# Altium project MotionBoard.PrjPcb (part 3 of 3)

## Sheet ext-memory.SchDoc: DSP External Memory
size A4; SheetNumber: 9; SheetTotal: 17
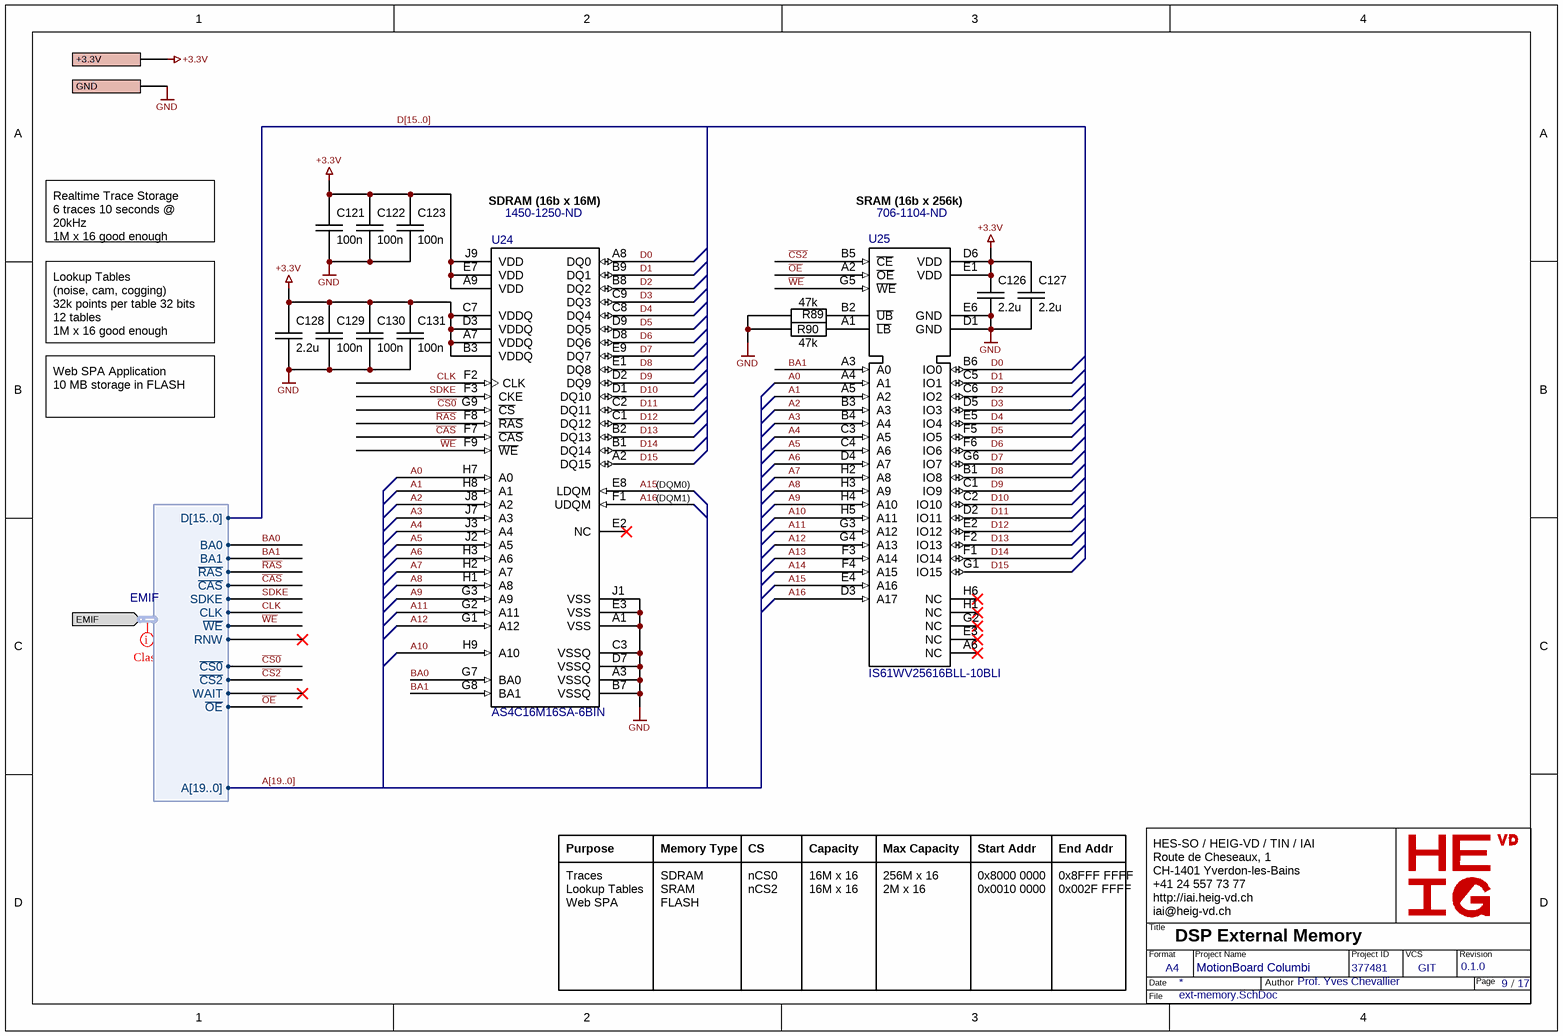
[diagram p10: ext-memory.SchDoc]

### Parts
C121  value 100n  [SM/C0201]  (hidden comment: CL05A104KP5NNNC)
C122  value 100n  [SM/C0201]  (hidden comment: CL05A104KP5NNNC)
C123  value 100n  [SM/C0201]  (hidden comment: CL05A104KP5NNNC)
C126  value 2.2u  [SM/C0402]  (hidden comment: CL05A225MQ5NNNC)
C127  value 2.2u  [SM/C0402]  (hidden comment: CL05A225MQ5NNNC)
C128  2.2u  [SM/C0402]
C129  value 100n  [SM/C0201]  (hidden comment: CL05A104KP5NNNC)
C130  value 100n  [SM/C0201]  (hidden comment: CL05A104KP5NNNC)
C131  value 100n  [SM/C0201]  (hidden comment: CL05A104KP5NNNC)
R89  47k  [SM/R0402]
R90  47k  [SM/R0402]
U24  AS4C16M16SA-6BIN  Supplier Part Number 1: 1450-1250-ND  [TFBGA-54]
U25  IS61WV25616BLL-10BLI  Supplier Part Number 1: 706-1104-ND  [BGA48C75P8X6_800X600X120N]

### Ports
+3.3V, EMIF (in, harness EMIF), GND

### Harnesses
EMIF: A[19..0], D[15..0], ~{RAS}, ~{CAS}, ~{OE}, SDKE, CLK, ~{CS0}, ~{CS2}, BA0, BA1, ~{WE}, RNW, WAIT

### Nets
+3.3V: C121.1 C122.1 C123.1 C126.1 C127.1 C128.1 C129.1 C130.1 C131.1 U24.A7(VDDQ) U24.A9(VDD) U24.B3(VDDQ) U24.C7(VDDQ) U24.D3(VDDQ) U24.E7(VDD) U24.J9(VDD) U25.D6(VDD) U25.E1(VDD) ; port +3.3V
GND: C121.2 C122.2 C123.2 C126.2 C127.2 C128.2 C129.2 C130.2 C131.2 R89.1 R90.1 U24.A1(VSS) U24.A3(VSSQ) U24.B7(VSSQ) U24.C3(VSSQ) U24.D7(VSSQ) U24.E3(VSS) U24.J1(VSS) U25.D1(GND) U25.E6(GND) ; port GND
A0: U24.H7(A0) U25.A4(A1)
A1: U24.H8(A1) U25.A5(A2)
A2: U24.J8(A2) U25.B3(A3)
A3: U24.J7(A3) U25.B4(A4)
A4: U24.J3(A4) U25.C3(A5)
A5: U24.J2(A5) U25.C4(A6)
A6: U24.H3(A6) U25.D4(A7)
A7: U24.H2(A7) U25.H2(A8)
A8: U24.H1(A8) U25.H3(A9)
A9: U24.G3(A9) U25.H4(A10)
A10: U24.H9(A10) U25.H5(A11)
A11: U24.G2(A11) U25.G3(A12)
A12: U24.G1(A12) U25.G4(A13)
A13: U25.F3(A14)
A14: U25.F4(A15)
A15: U24.E8(LDQM) U25.E4(A16)
A16: U24.F1(UDQM) U25.D3(A17)
BA0: U24.G7(BA0) ; port EMIF.BA0
BA1: U24.G8(BA1) U25.A3(A0) ; port EMIF.BA1
~{CAS}: U24.F7(~{CAS}) ; port EMIF.~{CAS}
~{CS0}: U24.G9(~{CS}) ; port EMIF.~{CS0}
~{CS2}: U25.B5(~{CE}) ; port EMIF.~{CS2}
CLK: U24.F2(CLK) ; port EMIF.CLK
D0: U24.A8(DQ0) U25.B6(IO0)
D1: U24.B9(DQ1) U25.C5(IO1)
D2: U24.B8(DQ2) U25.C6(IO2)
D3: U24.C9(DQ3) U25.D5(IO3)
D4: U24.C8(DQ4) U25.E5(IO4)
D5: U24.D9(DQ5) U25.F5(IO5)
D6: U24.D8(DQ6) U25.F6(IO6)
D7: U24.E9(DQ7) U25.G6(IO7)
D8: U24.E1(DQ8) U25.B1(IO8)
D9: U24.D2(DQ9) U25.C1(IO9)
D10: U24.D1(DQ10) U25.C2(IO10)
D11: U24.C2(DQ11) U25.D2(IO11)
D12: U24.C1(DQ12) U25.E2(IO12)
D13: U24.B2(DQ13) U25.F2(IO13)
D14: U24.B1(DQ14) U25.F1(IO14)
D15: U24.A2(DQ15) U25.G1(IO15)
~{OE}: U25.A2(~{OE}) ; port EMIF.~{OE}
~{RAS}: U24.F8(~{RAS}) ; port EMIF.~{RAS}
SDKE: U24.F3(CKE) ; port EMIF.SDKE
~{WE}: U24.F9(~{WE}) U25.G5(~{WE}) ; port EMIF.~{WE}
NetR89_2: R89.2 U25.B2(~{UB})
NetR90_2: R90.2 U25.A1(~{LB})

Not connected (* = marked no-connect by the designer): U24 E2(NC)*; U25 A6(NC)* E3(NC)* G2(NC)* H1(NC)* H6(NC)*

### Buses and harness runs
bus A[19..0]
bus D[15..0]

### Layout directives
net class EMIF: (no net found under the mark)

### Notes on the sheet
- Realtime Trace Storage
  6 traces 10 seconds @ 20kHz
  1M x 16 good enough
- SDRAM (16b x 16M)
- SRAM (16b x 256k)
- Lookup Tables
  (noise, cam, cogging)
  32k points per table 32 bits
  12 tables
  1M x 16 good enough
- Web SPA Application
  10 MB storage in FLASH
- (DQM0)
- (DQM1)
- Purpose
- Memory Type
- CS
- Capacity
- Max Capacity
- Start Addr
- End Addr
- Traces
- Web SPA
- Lookup Tables
- SDRAM
- SRAM
- FLASH
- nCS0
- nCS2
- 16M x 16
- 256M x 16
- 2M x 16
- 0x8000 0000
- 0x0010 0000
- 0x8FFF FFFF
- 0x002F FFFF
- HES-SO / HEIG-VD / TIN / IAI
  Route de Cheseaux, 1
  CH-1401 Yverdon-les-Bains
  +41 24 557 73 77
  http://iai.heig-vd.ch
  iai@heig-vd.ch
- Title
- Format
- Date
- A4
- Project Name
- Author
- Project ID
- VCS
- Revision
- Page
- /
- File

### Library data of the parts
C121-C123 C129-C131 = C: as C189-C193 on sheet adc; Supplier 1: Digi-Key; Supplier Part Number 1: 1276-1022-1-ND
C126 C127 = C: CAP CER 10UF 10V X5R 0805; Voltage: 6.3V; Supplier 1: Digi-Key; Supplier Part Number 1: 1276-1469-1-ND
C128 = C: GRM155R61C225KE11D; Dielectric: X5R; Voltage: 16V; Supplier 1: Digi-Key; Supplier Part Number 1: 490-10695-1-ND
R89 R90 = R: 47 kOhms ±1% 0.063W, 1/16W Chip Resistor 0402 (1005 Metric) Moisture Resistant Thick Film; Value: 47k; Supplier 1: Digi-Key; Supplier Part Number 1: 311-47.0KLRCT-ND
U24 = AS4C16M16SA-6BIN: IC DRAM 256MBIT PARALLEL 54TFBGA / SDRAM Memory IC 256Mb (16M x 16) Parallel 166 MHz 5 ns 54-TFBGA (8x8); Supplier 1: Digi-Key
U25 = IS61WV25616BLL-10BLI: SRAM - Asynchronous Memory IC 4Mb (256K x 16) Parallel 10 ns 48-TFBGA (6x8); Supplier 1: Digi-Key

## Sheet usb.SchDoc: Micro USB Host/Device Port
size A4; SheetNumber: 12; SheetTotal: 18
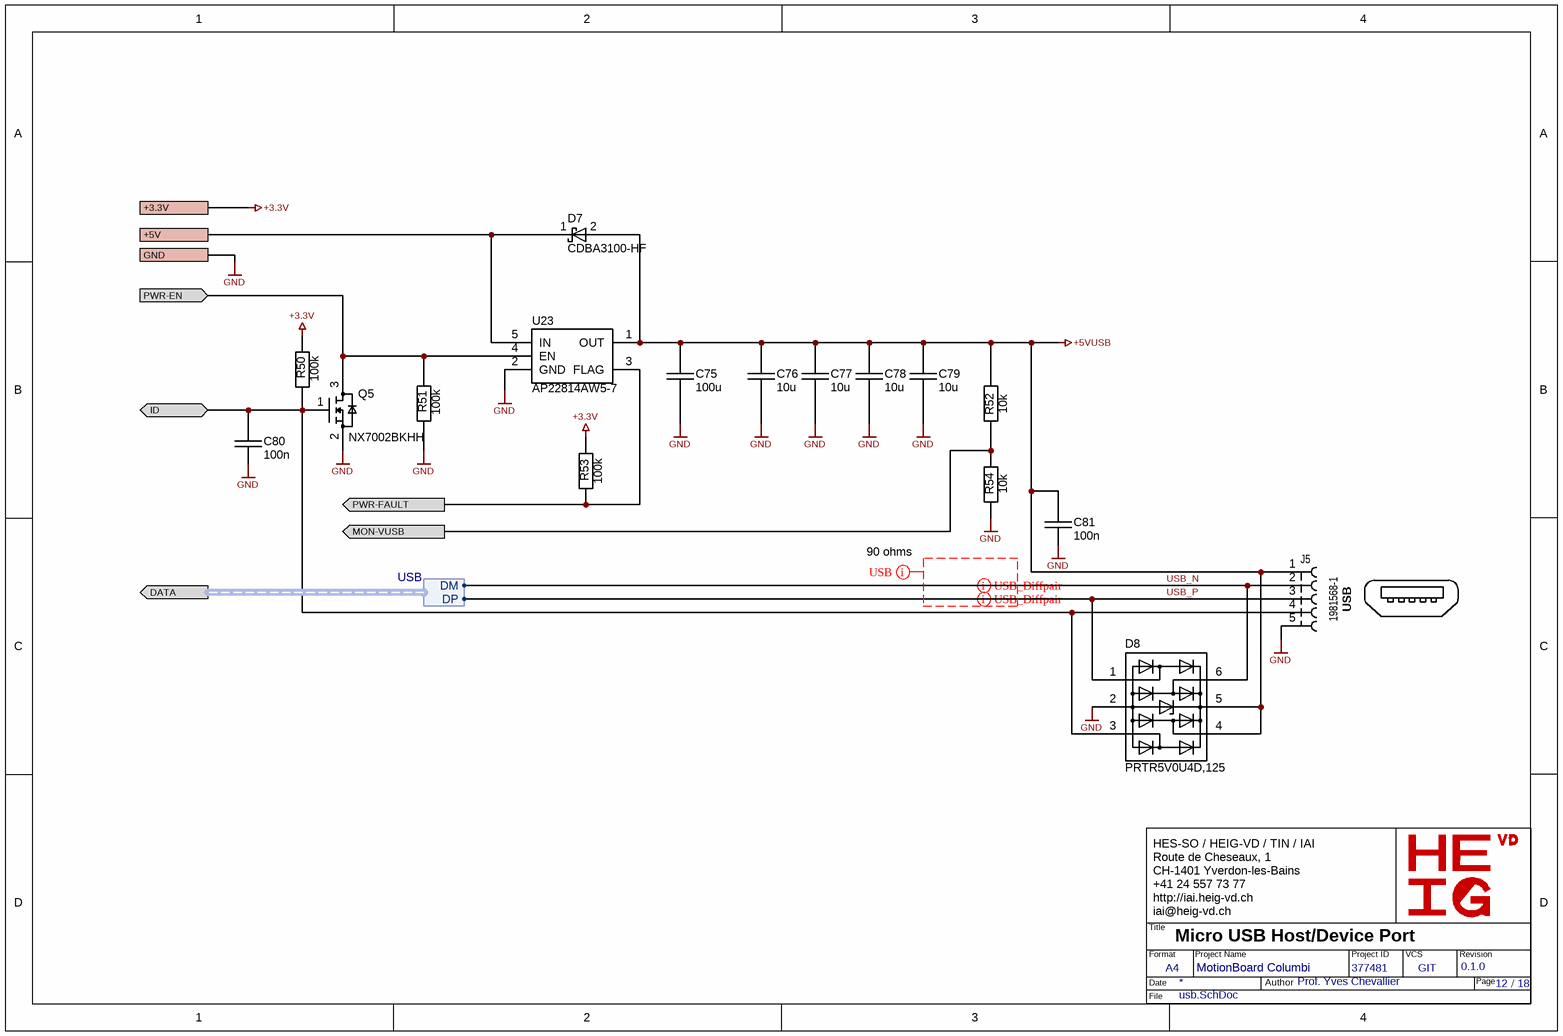
[diagram p11: usb.SchDoc]

### Parts
(Parts that share a designator on the sheet are numbered #1, #2 ... from top to bottom, then left to right.)
C75  100u  [SM/C1210]
C76  10u  [SM/C0603]
C77  10u  [SM/C0603]
C78  10u  [SM/C0603]
C79  10u  [SM/C0603]
C80  100n  [SM/C0402]
C81  100n  [SM/C0402]
D7  CDBA3100-HF  [DO214AC]
D8  PRTR5V0U4D,125  [SOT23-6]
J5#2  1981568-1  Function: USB  [TE/1981568-1/USB]
Q5  NX7002BKHH  [SOT8001/DFN0606-3]
R50  100k  [SM/R0805]
R51  100k  [SM/R0805]
R52  10k  [SM/R0402]
R53  100k  [SM/R0805]
R54  10k  [SM/R0402]
U23  AP22814AW5-7  [SOT23-5]

### Ports
+3.3V, +5V, DATA (out, harness USB), GND, ID (bidir), MON-VUSB (out), PWR-EN (in), PWR-FAULT (out)

### Harnesses
USB: DP, DM

### Nets
+3.3V: R50.2 R53.2 ; port +3.3V
+5V: D7.1(K) U23.5(IN) ; port +5V
+5VUSB: C75.1 C76.1 C77.1 C78.1 C79.1 C81.1 D7.2(A) D8.4(ESD3) D8.5(GND) J5#2.1 R52.2 U23.1(OUT)
GND: C75.2 C76.2 C77.2 C78.2 C79.2 C80.2 C81.2 D8.2(VCC) J5#2.5 Q5.2(VCC) R51.1 R54.1 U23.2(GND) ; port GND
ID: C80.1 D8.3(ESD2) J5#2.4 Q5.1(VCC) R50.1 ; port ID
MON-VUSB: R52.1 R54.2 ; port MON-VUSB
PWR-EN: Q5.3(VCC) R51.2 U23.4(EN) ; port PWR-EN
PWR-FAULT: R53.1 U23.3(FLAG) ; port PWR-FAULT
USB_N: D8.6(ESD4) J5#2.2 ; port DATA.DM
USB_P: D8.1(ESD1) J5#2.3 ; port DATA.DP

### Layout directives
differential pair: USB_N, USB_P
rule Impedance Constraint [Min = 85.00    Max = 95.00    ]; Impedance: 90 ohms; rule Differential Pairs Routing [Pref Gap = 6.43mil    Min Gap  = 5.906mil    Max Gap  = 6.43milPref Width = 9.048mil    Min Width  = 5.906mil    Max Width  = 9.048mil]; rule Matched Net Lengths [Tolerance = 10mil]; net class USB: (no net found under the mark)

### Notes on the sheet
- HES-SO / HEIG-VD / TIN / IAI
  Route de Cheseaux, 1
  CH-1401 Yverdon-les-Bains
  +41 24 557 73 77
  http://iai.heig-vd.ch
  iai@heig-vd.ch
- Title
- Format
- Date
- A4
- Project Name
- Author
- Project ID
- VCS
- Revision
- Page
- /
- File

### Library data of the parts
C75 = CAP CER 100UF 10V X5R 1210: 100 µF ±20% 10V Ceramic Capacitor X5R 1210 (3225 Metric); Supplier 1: Digi-Key; Supplier Part Number 1: 1276-3364-1-ND; Value: 100u; Voltage: 10V; Dielectric: X5R
C76-C79 = CAP CER 10UF 25V X5R 0603: 10 µF ±20% 25V Ceramic Capacitor X5R 0603 (1608 Metric); Dielectric: X7R; Supplier 1: Digi-Key; Supplier Part Number 1: 490-7202-1-ND; Voltage: 25V; Value: 10u
C80 C81 = CAP CER 100NF 25V X5R 0402: 100 nF ±10% 25V Ceramic Capacitor X5R 0402 (1005 Metric); Voltage: 25V; Dielectric: X5R; Supplier 1: Digi-Key; Supplier Part Number 1: 1276-1043-1-ND; Value: 100n
D7 = DIODE SCHOTTKY 100V 3A DO214AC: Diode 100 V 3A Surface Mount DO-214AC (SMA); Supplier 1: Digi-Key; Supplier Part Number 1: 641-1747-1-ND
D8 = PRTR5V0U4D: Ultra low capacitance quadruple rail-to-rail ESD protection, surface mount 6-TSOP; Mounting: SMD; Supplier 1: Digi-Key; Supplier Part Number 1: 1727-3890-1-ND; Supplier 2: Mouser; Supplier Part Number 2: 771-PRTR5V0U4D-T/R
J5#2 = CONN 5 Socket: USB - micro B USB 2.0 Receptacle Connector 5 Position Surface Mount, Right Angle; Supplier 1: Digi-Key; Supplier Part Number 1: A97800CT-ND
Q5 = 2N7002: N-Channel 60 V 350mA (Ta) 380mW (Ta), 2.8W (Tc) Surface Mount DFN0606-3; Value: 2N7002; Supplier 1: Digi-Key; Supplier Part Number 1: 1727-8574-1-ND
R50 R51 R53 = RES 100K OHM 1% 1/16W 0402: 100 kOhms ±1% 0.063W, 1/16W Chip Resistor 0402 (1005 Metric) Moisture Resistant Thick Film; Supplier 1: Digi-Key; Supplier Part Number 1: 13-RC0402FR-13100KLCT-ND; Value: 100k
R52 R54 = RES 10K OHM 1% 1/16W 0402: 10 kOhms ±1% 0.063W, 1/16W Chip Resistor 0402 (1005 Metric) Moisture Resistant Thick Film; Supplier 1: Digi-Key; Supplier Part Number 1: 1276-3431-1-ND; Value: 10k
U23 = AP22804: Power Switch/Driver 1:1 P-Channel 3A SOT-25; Supplier 1: Digi-Key; Supplier Part Number 1: AP22814AW5-7DICT-ND

## Sheet resolver-excitation.SchDoc: Resolver Excitation
size A4; SheetNumber: 12; SheetTotal: 17
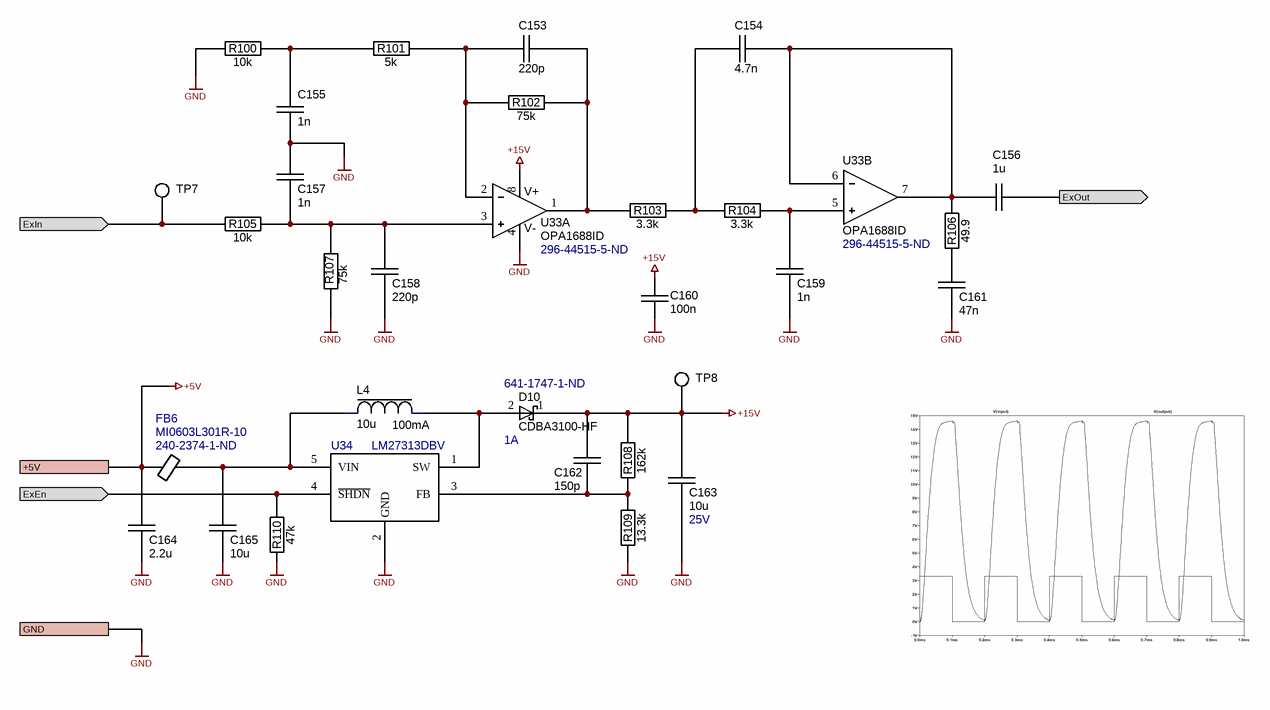
[diagram p12: resolver-excitation.SchDoc]

### Parts
(Parts that share a designator on the sheet are numbered #1, #2 ... from top to bottom, then left to right.)
C153  220p  [SM/C0402]
C154  4.7n  [SM/C0402]
C155  1n  [SM/C0402]
C156  1u  [SM/C0402]
C157  1n  [SM/C0402]
C158  220p  [SM/C0402]
C159  1n  [SM/C0402]
C160  100n  [SM/C0402]
C161  47n  [SM/C0402]
C162  150p  [SM/C0603]
C163  10u  Voltage: 25V  [SM/C0603]
C164  2.2u  [SM/C0402]
C165  10u  [SM/C0603]
D10  CDBA3100-HF  Current: 1A  Supplier Part Number 1: 641-1747-1-ND  [DO214AC]
FB6#2  MI0603L301R-10  Supplier Part Number 1: 240-2374-1-ND  [SM/L0603]
L4  10u  Isat: 100mA  [SM/L0805]
R100  10k  [SM/R0402]
R101  5k  [SM/R0402]
R102  75k  [SM/R0402]
R103  3.3k  [SM/R0402]
R104  3.3k  [SM/R0402]
R105  10k  [SM/R0402]
R106  49.9  [SM/R0402]
R107  75k  [SM/R0402]
R108  162k  [SM/R0402]
R109  13.3k  [SM/R0402]
R110  47k  [SM/R0402]
TP7#2  RCUCTE  [TP/RCUCT]  (value not drawn)
TP8  RCUCTE  [TP/RCUCT]  (value not drawn)
U33  OPA1688ID  Supplier Part Number 1: 296-44515-5-ND  [SOIC8]  (parts A,B of 2)
U34  LM27313DBV  [SOT23-6]

### Ports
+5V, ExEn (in), ExIn (in), ExOut (out), GND

### Nets
+5V: C164.1 FB6#2.1 ; port +5V
+15V: C160.1 C162.1 C163.1 D10.1(K) R108.1 TP8.1 U33.8(V+)
GND: C155.2 C157.1 C158.2 C159.2 C160.2 C161.2 C163.2 C164.2 C165.2 R100.2 R107.1 R109.1 R110.1 U33.4(V-) U34.2(GND) ; port GND
ExEn: R110.2 U34.4(~{SHDN}) ; port ExEn
ExIn: R105.1 TP7#2.1 ; port ExIn
ExOut: C156.2 ; port ExOut
NetC153_1: C153.1 R101.1 R102.2 U33.2(IN-)
NetC153_2: C153.2 R102.1 R103.2 U33.1(OUT)
NetC154_1: C154.1 R103.1 R104.2
NetC154_2: C154.2 C156.1 R106.1 U33.6(IN-) U33.7(OUT)
NetC155_1: C155.1 R100.1 R101.2
NetC157_2: C157.2 C158.1 R105.2 R107.2 U33.3(IN+)
NetC159_1: C159.1 R104.1 U33.5(IN+)
NetC161_1: C161.1 R106.2
NetC162_2: C162.2 R108.2 R109.2 U34.3(FB)
NetC165_1: C165.1 FB6#2.2 L4.2 U34.5(VIN)
NetD10_2: D10.2(A) L4.1 U34.1(SW)

### Notes on the sheet
- HES-SO / HEIG-VD / TIN / IAI
  Route de Cheseaux, 1
  CH-1401 Yverdon-les-Bains
  +41 24 557 73 77
  http://iai.heig-vd.ch
  iai@heig-vd.ch
- Title
- Format
- Date
- A4
- Project Name
- Author
- Project ID
- VCS
- Revision
- Page
- /
- File

### Library data of the parts
C153 C158 = C: 220 pF ±5% 50V Ceramic Capacitor C0G, NP0 0402 (1005 Metric); Dielectric: NPO; Voltage: 50V; Supplier 1: Digi-Key; Supplier Part Number 1: 1276-1059-1-ND
C154 C162 = C: as C189-C193 on sheet adc
C155 C157 C159 = C: GRM1555C1H102JA01D; Voltage: 50V; Dielectric: NPO; Supplier 1: Digi-Key; Supplier Part Number 1: 490-3244-1-ND; Value: 1n
C156 = C: TMK105BJ105MV-F; Voltage: 25V; Dielectric: X5R; Supplier 1: Digi-Key; Supplier Part Number 1: 587-3245-1-ND; Value: 1u
C160 = C: 0.1 µF ±10% 25V Ceramic Capacitor X5R 0402 (1005 Metric); Voltage: 25V; Dielectric: X5R; Supplier 1: Digi-Key; Supplier Part Number 1: 1276-1043-1-ND; Value: 100n
C161 = C: 0.047 µF ±10% 25V Ceramic Capacitor X7R 0402 (1005 Metric); Voltage: 25V; Dielectric: X7R; Supplier 1: Digi-Key; Supplier Part Number 1: 1276-CL05B473KA5VPNCCT-ND; Value: 47n
C163 = C: 10 µF ±20% 25V Ceramic Capacitor X5R 0603 (1608 Metric); Dielectric: X7R; Supplier 1: Digi-Key; Supplier Part Number 1: 490-7202-1-ND; Value: 10u
C164 = C: CAP CER 10UF 10V X5R 0805; Supplier 1: Digi-Key; Supplier Part Number 1: 1276-2402-1-ND
C165 = C: 10 µF ±20% 25V Ceramic Capacitor X5R 0603 (1608 Metric); Voltage: 16V; Dielectric: X7R; Supplier 1: Digi-Key; Supplier Part Number 1: 490-7202-1-ND; Value: 10u
D10 = D SCHOTTKY: Supplier 1: Digi-Key
FB6#2 = FB0603: Supplier 1: Digi-Key
L4 = L: FIXED IND 10UH 300MA 845MOHM SMD; Value: 10u; Supplier 1: Digi-Key; Supplier Part Number 1: 490-18463-1-ND
R100 R105 = R: 10 kOhms ±1% 0.063W, 1/16W Chip Resistor 0402 (1005 Metric) Moisture Resistant Thick Film; Supplier 1: Digi-Key; Supplier Part Number 1: 1276-3431-1-ND; Value: 10k
R101 = R: 5 kOhms ±1% 0.063W, 1/16W Chip Resistor 0402 (1005 Metric) Moisture Resistant Thick Film; Supplier 1: Digi-Key; Supplier Part Number 1: 13-RC0402FR-075KLCT-ND; Value: 5k
R102 R107 = R: 75 kOhms ±1% 0.063W, 1/16W Chip Resistor 0402 (1005 Metric) Moisture Resistant Thick Film; Supplier 1: Digi-Key; Supplier Part Number 1: 311-75KLRCT-ND; Value: 75k
R103 R104 = R: 3.3 kOhms ±1% 0.063W, 1/16W Chip Resistor 0402 (1005 Metric) Moisture Resistant Thick Film; Supplier 1: Digi-Key; Supplier Part Number 1: 311-3.30KLRCT-ND; Value: 3.3k
R106 = R: RC0402FR-0749R9L; Supplier 1: Digi-Key; Supplier Part Number 1: 311-49.9LRCT-ND; Value: 49.9
R108 = R: Chip Resistor SMD
R109 = R: 13.3 kOhms ±1% 0.063W, 1/16W Chip Resistor 0402 (1005 Metric) Moisture Resistant Thick Film; Supplier 1: Digi-Key; Supplier Part Number 1: YAG2974CT-ND; Value: 13.3k
R110 = R: as R89 on sheet ext-memory; Supplier 1: Digi-Key; Supplier Part Number 1: 311-47.0KLRCT-ND
TP7#2 TP8 = TP: PC Test Point Plating Surface Mount Mounting Type; Supplier 1: Digi-Key; Supplier Part Number 1: 2019-RCUCTECT-ND
U33 = OPA1688: Dual operational amplifier; Supplier 1: Digi-Key
U34 = LM27313DBV: Boost Switching Regulator IC Positive Adjustable 5V 1 Output 800mA (Switch) SC-74A, SOT-753; Supplier 1: Digi-Key; Supplier Part Number 1: LM27313XMF/NOPBCT-ND

## Sheet analog-encoder.SchDoc: Encoder Interface INC/1Vpp/Resolver
size A3; SheetNumber: 9; SheetTotal: 18
Used 2 times, as channels U_ENC-C, U_ENC-D. Parts and nets are listed once, with the designators drawn on the sheet.
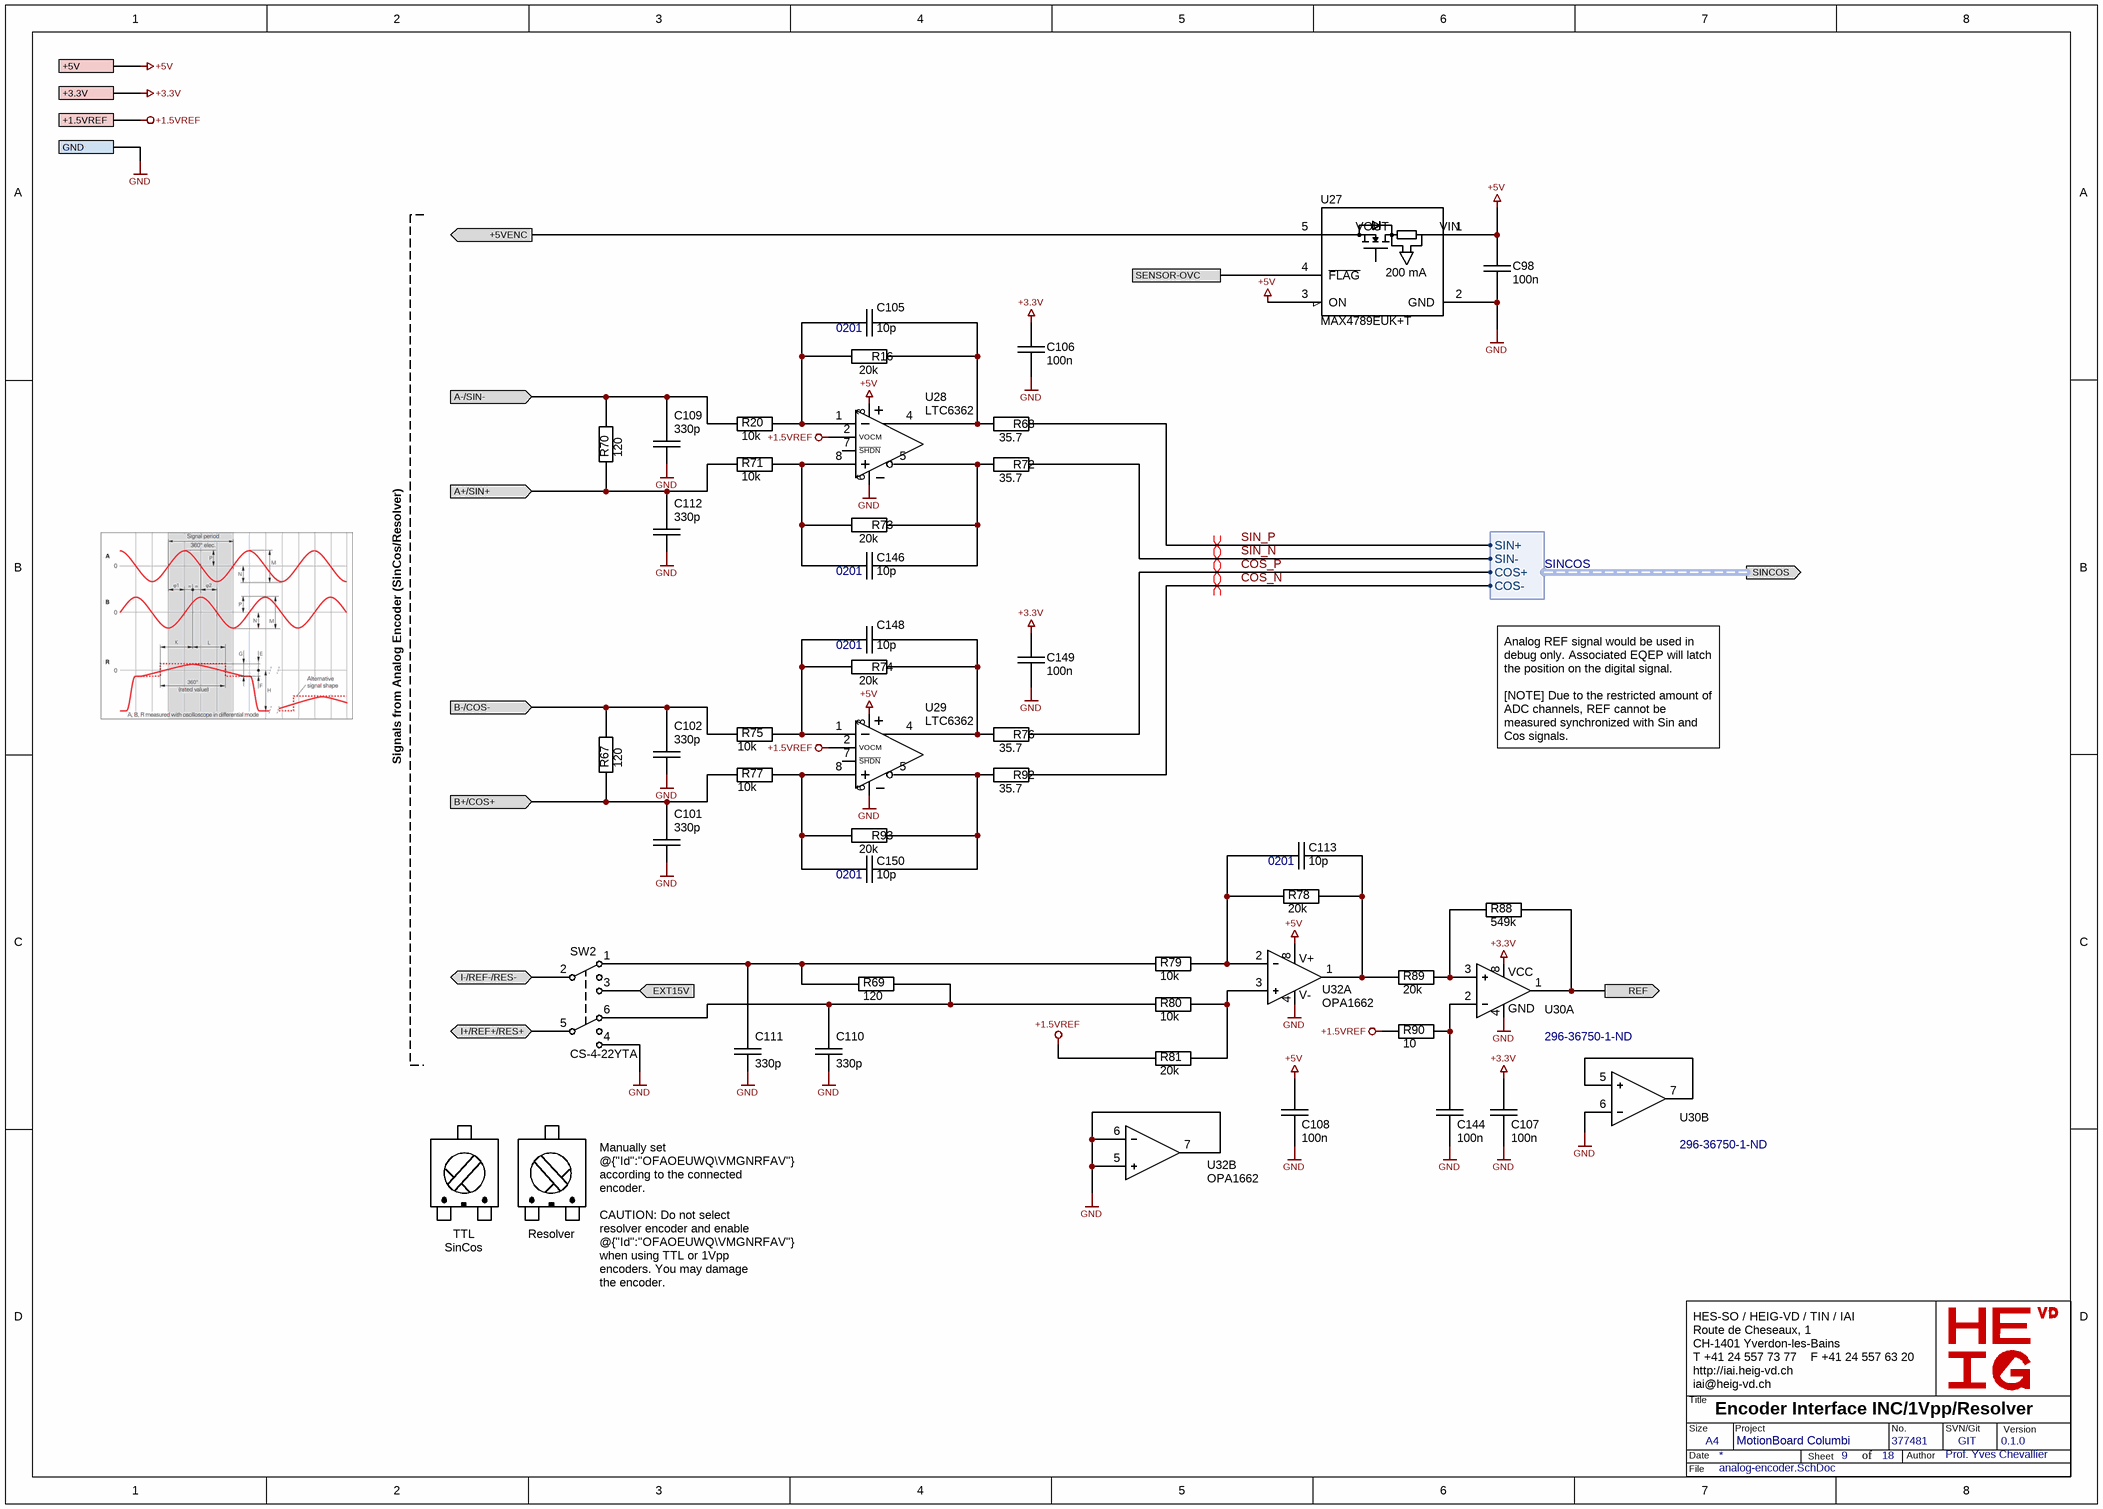
[diagram p13: analog-encoder.SchDoc]

### Parts
C98  100n  [SM/C0402]
C101  330p  [SM/C0402]
C102  330p  [SM/C0402]
C105  10p  Case: 0201  [SM/C0201]
C106  100n  [SM/C0402]
C107  100n  [SM/C0402]
C108  100n  [SM/C0402]
C109  330p  [SM/C0402]
C110  330p  [SM/C0402]
C111  330p  [SM/C0402]
C112  330p  [SM/C0402]
C113  10p  Case: 0201  [SM/C0201]
C144  100n  [SM/C0402]
C146  10p  Case: 0201  [SM/C0201]
C148  10p  Case: 0201  [SM/C0201]
C149  100n  [SM/C0402]
C150  10p  Case: 0201  [SM/C0201]
R16  20k  [SM/R0402]
R20  10k  [SM/R0402]
R67  120  [SM/R0402]
R68  35.7  [SM/R0402]
R69  120  [SM/R0402]
R70  120  [SM/R0402]
R71  10k  [SM/R0402]
R72  35.7  [SM/R0402]
R73  20k  [SM/R0402]
R74  20k  [SM/R0402]
R75  10k  [SM/R0402]
R76  35.7  [SM/R0402]
R77  10k  [SM/R0402]
R78  20k  [SM/R0402]
R79  10k  [SM/R0402]
R80  10k  [SM/R0402]
R81  20k  [SM/R0402]
R88  549k  [SM/R0402]
R89  20k  [SM/R0402]
R90  10  [SM/R0402]
R92  35.7  [SM/R0402]
R93  20k  [SM/R0402]
SW2  CS-4-22YTA  [CS-4-22YA]
U27  MAX4789EUK+T  [SOT23-5]
U28  LTC6362
U29  LTC6362
U30  Supplier Part Number 1: 296-36750-1-ND  (parts A,B of 2)
U32  OPA1662  [SOIC8]  (parts A,B of 2)

### Ports
+1.5VREF, +3.3V, +5V, +5VENC (out), A+/SIN+ (in), A-/SIN- (in), B+/COS+ (in), B-/COS- (in), EXT15V (in), GND, I+/REF+/RES+ (bidir), I-/REF-/RES- (bidir), REF (out), SENSOR-OVC, SINCOS (out, harness SINCOS)

### Harnesses
SINCOS: SIN+, COS+, SIN-, COS-

### Nets
+1.5VREF: R81.2 R90.2 U28.2(VOCM) U29.2(VOCM) ; port +1.5VREF
+3.3V: C106.2 C107.2 C149.2 U30.8(V+) ; port +3.3V
+5V: C98.1 C108.2 U27.1(VIN) U27.3(ON) U28.3(V+) U29.3(V+) U32.8(V+) ; port +5V
GND: C98.2 C101.2 C102.2 C106.1 C107.1 C108.1 C109.2 C110.2 C111.2 C112.2 C144.1 C149.1 SW2.4(2B) U27.2(GND) U28.6(V+) U29.6(V+) U30.4(GND) U30.6(IN-) U32.4(V-) U32.5(IN+) U32.6(IN-) U32.7(OUT) ; port GND
+5VENC: U27.5(VOUT) ; port +5VENC
A+/SIN+: C112.1 R70.2 R71.2 ; port A+/SIN+
A-/SIN-: C109.1 R20.2 R70.1 ; port A-/SIN-
B+/COS+: C101.1 R67.2 R77.2 ; port B+/COS+
B-/COS-: C102.1 R67.1 R75.2 ; port B-/COS-
COS_N: R92.1 ; port SINCOS.COS-
COS_P: R76.1 ; port SINCOS.COS+
EXT15V: SW2.3(1A) ; port EXT15V
I+/REF+/RES+: SW2.5(CB) ; port I+/REF+/RES+
I-/REF-/RES-: SW2.2(CA) ; port I-/REF-/RES-
REF: R88.1 U30.1(OUT) ; port REF
SENSOR-OVC: U27.4(~{FLAG}) ; port SENSOR-OVC
SIN_N: R72.1 ; port SINCOS.SIN-
SIN_P: R68.1 ; port SINCOS.SIN+
NetC105_1: C105.1 R16.1 R68.2 U28.4(OUT+)
NetC105_2: C105.2 R16.2 R20.1 U28.1(IN-)
NetC110_1: C110.1 R69.1 R80.2 SW2.6(1B)
NetC111_1: C111.1 R69.2 R79.2 SW2.1(2A)
NetC113_1: C113.1 R78.1 R89.2 U32.1(OUT)
NetC113_2: C113.2 R78.2 R79.1 U32.2(IN-)
NetC144_2: C144.2 R90.1 U30.2(IN-)
NetC146_1: C146.1 R72.2 R73.1 U28.5(OUT-)
NetC146_2: C146.2 R71.1 R73.2 U28.8(IN+)
NetC148_1: C148.1 R74.1 R76.2 U29.4(OUT+)
NetC148_2: C148.2 R74.2 R75.1 U29.1(IN-)
NetC150_1: C150.1 R92.2 R93.1 U29.5(OUT-)
NetC150_2: C150.2 R77.1 R93.2 U29.8(IN+)
NetR80_1: R80.1 R81.1 U32.3(IN+)
NetR88_2: R88.2 R89.1 U30.3(IN+)
NetU30_5: U30.5(IN+) U30.7(OUT)

Not connected (* = marked no-connect by the designer): U28 7(~{SHDN}); U29 7(~{SHDN})

### Channels
U_ENC-C: designators end in A; ports +1.5VREF=+1.5VREF +3.3V=+3.3V +5V=+5V +5VENC=+5VENCC A+/SIN+=ENCC-A+ A-/SIN-=ENCC-A- B+/COS+=ENCC-B+ B-/COS-=ENCC-B- EXT15V=ExOut GND=GND I+/REF+/RES+=ENCC-C+ I-/REF-/RES-=ENCC-C- REF=REF_U_ENC-C SENSOR-OVC=SENSOR-OVC_U_ENC-C
U_ENC-D: designators end in B; ports +1.5VREF=+1.5VREF +3.3V=+3.3V +5V=+5V +5VENC=+5VENCD A+/SIN+=ENCD-A+ A-/SIN-=ENCD-A- B+/COS+=ENCD-B+ B-/COS-=ENCD-B- EXT15V=ExOut GND=GND I+/REF+/RES+=ENCD-C+ I-/REF-/RES-=ENCD-C- REF=REF_U_ENC-D SENSOR-OVC=SENSOR-OVC_U_ENC-D

### Layout directives
differential pair: COS_N_U_ENC-C, COS_P_U_ENC-C, SIN_N_U_ENC-C, SIN_P_U_ENC-C

### Notes on the sheet
- Signals from Analog Encoder (SinCos/Resolver)
- Analog REF signal would be used in debug only. Associated EQEP will latch the position on the digital signal.
  [NOTE] Due to the restricted amount of ADC channels, REF cannot be measured synchronized with Sin and Cos signals.
- SinCos
- TTL
- Resolver
- Manually set @{"Id":"OFAOEUWQ\VMGNRFAV"} according to the connected encoder.
  CAUTION: Do not select resolver encoder and enable @{"Id":"OFAOEUWQ\VMGNRFAV"} when using TTL or 1Vpp encoders. You may damage the encoder.
- HES-SO / HEIG-VD / TIN / IAI
  Route de Cheseaux, 1
  CH-1401 Yverdon-les-Bains
  T +41 24 557 73 77    F +41 24 557 63 20
  http://iai.heig-vd.ch
  iai@heig-vd.ch
- Title
- Size
- Date
- A4
- Project
- Sheet
- of
- No.
- Author
- SVN/Git
- Version
- File
- (in symbol MAX4789) 200 mA
- (in symbol TLV3201, part A) VCC

### Library data of the parts
C98 C106-C108 C144 C149 = CAP CER 100NF 25V X5R 0402: as C80 on sheet usb; Voltage: 25V; Dielectric: X5R; Supplier 1: Digi-Key; Supplier Part Number 1: 1276-1043-1-ND; Value: 100n
C101 C102 C109-C112 = CAP CER 330PF 50V C0G/NP0 0402: 330 pF ±5% 50V Ceramic Capacitor C0G, NP0 0402 (1005 Metric); Dielectric: NPO; Voltage: 50V; Supplier 1: Digi-Key; Supplier Part Number 1: 490-4928-1-ND; Value: 330p
C105 C113 C146 C148 C150 = CAP CER 10PF 25V C0G/NP0 0201: 10 pF ±5% 25V Ceramic Capacitor C0G, NP0 0201 (0603 Metric); Dielectric: X7R; Voltage: 25V; Supplier 1: Digi-Key; Supplier Part Number 1: 490-8607-1-ND; Value: 10p
R16 R68 R72-R74 R76 R78 R81 R89 R92 R93 = RES 20K OHM 1% 1/16W 0402: as R18 on sheet psu; Supplier 1: Digi-Key; Supplier Part Number 1: 311-20.0KLRCT-ND
  R16 R73 R74 R78 R81 R89 R93: Value: 20k
  R68 R72 R76 R92: Value: 35.7
R20 R71 R75 R77 R79 R80 = RES 10K OHM 1% 1/16W 0402: as R52 on sheet usb; Supplier 1: Digi-Key; Supplier Part Number 1: 1276-3431-1-ND; Value: 10k
R67 R69 R70 = RES 120 OHM 1% 1/16W 0402: 120 Ohms ±1% 0.063W, 1/16W Chip Resistor 0402 (1005 Metric) Moisture Resistant Thick Film; Supplier 1: Digi-Key; Supplier Part Number 1: 311-120LRCT-ND; Value: 120
R88 R90 = RES 20K OHM 1% 1/16W 0402: 20 kOhms ±1% 0.063W, 1/16W Chip Resistor 0402 (1005 Metric) Moisture Resistant Thick Film; Value: 20k; Supplier 1: Digi-Key; Supplier Part Number 1: 311-20.0KLRCT-ND
SW2 = CS-4-22YTA: Dip Switch DPDT 2 Position Surface Mount Rotary for Tool Actuator 100mA 16VDC; Supplier 1: Digi-Key; Supplier Part Number 1: 563-1039-1-ND
U27 = MAX4789: Current Limiting Regulator 200mA SOT-23-5; Voltage: 2.3..5.5V; Supplier 1: Digi-Key; Supplier Part Number 1: MAX4789EUK+TCT-ND
U30 = TLV3201: Comparator General Purpose Push-Pull SOT-23-5 / IC COMPARATOR RRI SGL SOT23-5; Supplier 1: Digi-Key
U32 = OPA1662: Dual operational amplifier; Supplier 1: Digi-Key; Supplier Part Number 1: 296-36692-1-ND

## Sheet imu.SchDoc: IMU (Inertial Unit)
size A4; SheetNumber: 15; SheetTotal: 16
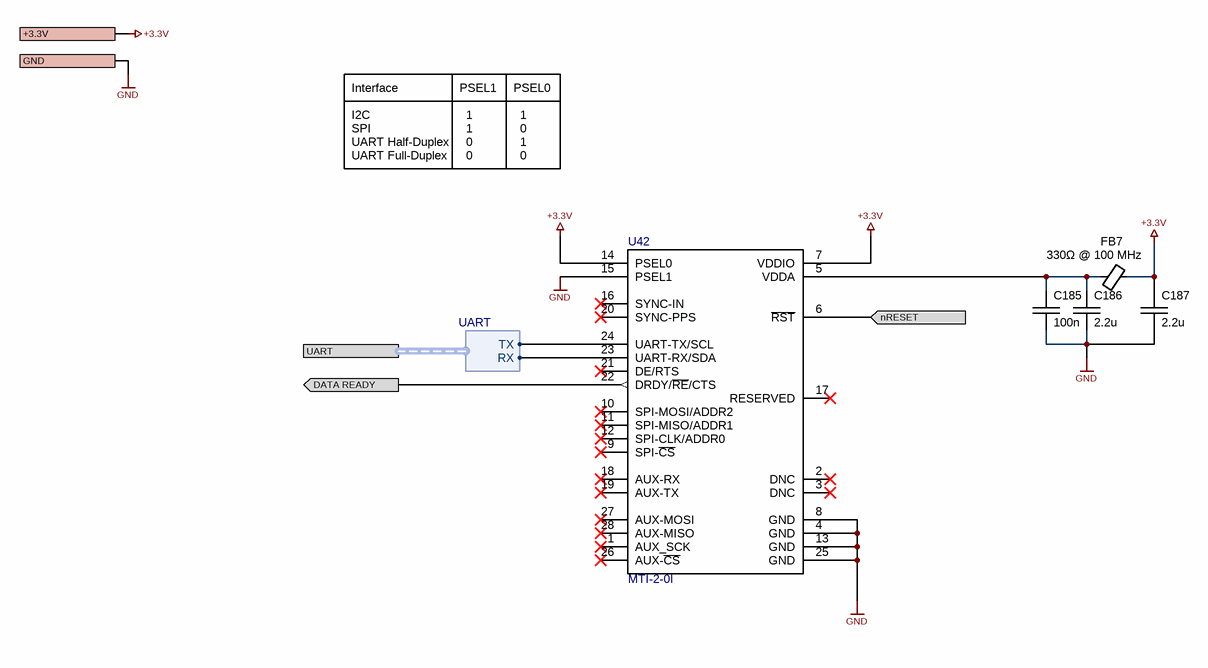
[diagram p14: imu.SchDoc]

### Parts
(Parts that share a designator on the sheet are numbered #1, #2 ... from top to bottom, then left to right.)
C185  value 100n  [SM/C0402]  (hidden comment: CL05A104KP5NNNC)
C186  value 2.2u  [SM/C0402]  (hidden comment: CL05A225MQ5NNNC)
C187  value 2.2u  [SM/C0402]  (hidden comment: CL05A225MQ5NNNC)
FB7#2  value 330Ω @ 100 MHz  [SM/L0603]  (hidden comment: BLM18KG331SN1D)
U42  MTI-2-0I  [MTi-1_PLCC_28P]

### Ports
+3.3V, DATA READY (out), GND, nRESET (in), UART (harness UART)

### Harnesses
UART: TX, RX

### Nets
+3.3V: C187.1 FB7#2.2 U42.7(VDDIO) U42.14(PSEL0) ; port +3.3V
GND: C185.2 C186.2 C187.2 U42.4(GND) U42.8(GND) U42.13(GND) U42.15(PSEL1) U42.25(GND) ; port GND
DATA READY: U42.22(DRDY/~{RE}/CTS) ; port DATA READY
IMU-~{RST}: U42.6(~{RST}) ; port nRESET
NetC185_1: C185.1 C186.1 FB7#2.1 U42.5(VDDA)
NetU8_D2: U42.24(UART-TX/SCL) ; port UART.TX
NetU8_D3: U42.23(UART-RX/SDA) ; port UART.RX

Not connected (* = marked no-connect by the designer): U42 1(AUX_SCK)* 2(DNC)* 3(DNC)* 9(SPI-~{CS})* 10(SPI-MOSI/ADDR2)* 11(SPI-MISO/ADDR1)* 12(SPI-CLK/ADDR0)* 16(SYNC-IN)* 17(RESERVED)* 18(AUX-RX)* 19(AUX-TX)* 20(SYNC-PPS)* 21(DE/RTS)* 26(AUX-~{CS})* 27(AUX-MOSI)* 28(AUX-MISO)*

### Notes on the sheet
- I2C
- SPI
- Interface
- PSEL1
- 1
- PSEL0
- 0
- UART Half-Duplex
- UART Full-Duplex
- HES-SO / HEIG-VD / TIN / IAI
  Route de Cheseaux, 1
  CH-1401 Yverdon-les-Bains
  +41 24 557 73 77
  http://iai.heig-vd.ch
  iai@heig-vd.ch
- Title
- Format
- Date
- A4
- Project Name
- Author
- Project ID
- VCS
- Revision
- Page
- /
- File

### Library data of the parts
C185 = C: as C189-C193 on sheet adc; Supplier 1: Digi-Key; Supplier Part Number 1: 1276-1022-1-ND
C186 C187 = C: CAP CER 10UF 10V X5R 0805; Voltage: 6.3V; Supplier 1: Digi-Key; Supplier Part Number 1: 1276-1469-1-ND
FB7#2 = FB0603: FERRITE BEAD 330 OHM 0603 1LN / 330 Ohms @ 100 MHz 1 Power Line Ferrite Bead 0603 (1608 Metric) 1.7A 80mOhm; Supplier 1: Digi-Key; Supplier Part Number 1: 490-5256-1-ND
U42 = XSENS MTI-x: Accelerometer, Gyroscope, Magnetometer, 9 Axis Sensor I²C, SPI, UART Output / 1551-MTI-2-0I-ND; Supplier 1: Digi-Key; Supplier Part Number 1: 1551-MTI-2-0I-ND

## Sheet sdcard.SchDoc: SD CARD
size A4; SheetNumber: 16; SheetTotal: 17
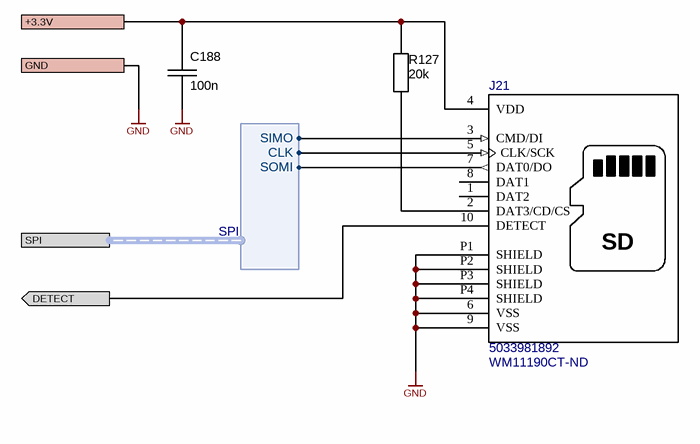
[diagram p15: sdcard.SchDoc]

### Parts
C188  100n  [SM/C0402]
J21  5033981892  Supplier Part Number 1: WM11190CT-ND  [MOLEX_503398-1892]
R127  20k  [SM/R0402]

### Ports
+3.3V, DETECT (out), GND, SPI (harness SPI)

### Harnesses
SPI: SIMO, SOMI, CLK

### Nets
+3.3V: C188.1 J21.4(VDD) R127.1 ; port +3.3V
GND: C188.2 J21.6(VSS) J21.9(VSS) J21.P1(SHIELD) J21.P2(SHIELD) J21.P3(SHIELD) J21.P4(SHIELD) ; port GND
DETECT: J21.10(DETECT) ; port DETECT
NetJ21_2: J21.2(DAT3/CD/CS) R127.2
NetJ21_3: J21.3(CMD/DI) ; port SPI.SIMO
NetJ21_5: J21.5(CLK/SCK) ; port SPI.CLK
NetJ21_7: J21.7(DAT0/DO) ; port SPI.SOMI

Not connected (* = marked no-connect by the designer): J21 1(DAT2) 8(DAT1)

### Notes on the sheet
- HES-SO / HEIG-VD / TIN / IAI
  Route de Cheseaux, 1
  CH-1401 Yverdon-les-Bains
  +41 24 557 73 77
  http://iai.heig-vd.ch
  iai@heig-vd.ch
- Title
- Format
- Date
- A4
- Project Name
- Author
- Project ID
- VCS
- Revision
- Page
- /
- File
- (in symbol CONN SD MOLEX 503398-1892) SD

### Library data of the parts
C188 = C: as C160 on sheet resolver-excitation; Voltage: 25V; Dielectric: X5R; Supplier 1: Digi-Key; Supplier Part Number 1: 1276-1043-1-ND; Value: 100n
J21 = CONN SD MOLEX 503398-1892: Supplier 1: Digi-Key
R127 = R: 20 kOhms ±1% 0.063W, 1/16W Chip Resistor 0402 (1005 Metric) Moisture Resistant Thick Film; Supplier 1: Digi-Key; Supplier Part Number 1: 311-20.0KLRCT-ND; Value: 20k

## Sheet mechanical.SchDoc: Mechanical Elements
size A4; SheetNumber: 17; SheetTotal: 21
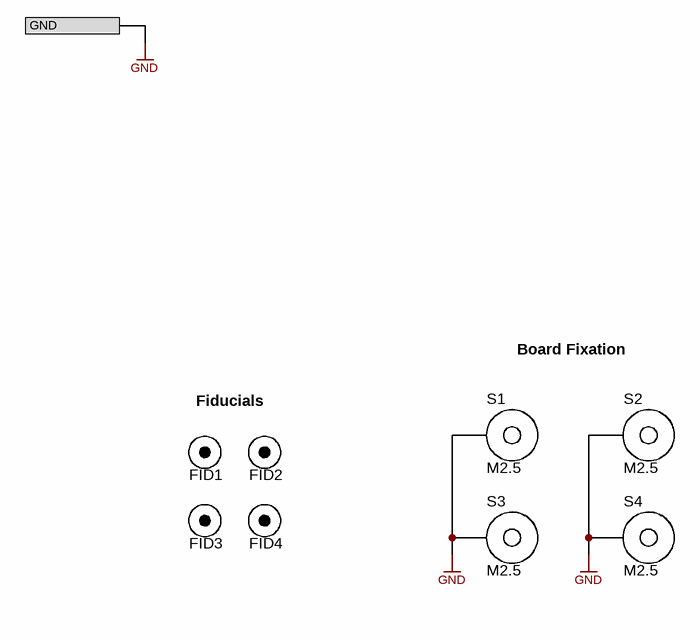
[diagram p16: mechanical.SchDoc]

### Parts
FID1  Fiducial 1.5 mm  [FIDUCIAL]  (value not drawn)  (no BOM)
FID2  Fiducial 1.5 mm  [FIDUCIAL]  (value not drawn)  (no BOM)
FID3  Fiducial 1.5 mm  [FIDUCIAL]  (value not drawn)  (no BOM)
FID4  Fiducial 1.5 mm  [FIDUCIAL]  (value not drawn)  (no BOM)
S1  M2.5  [HW/HOLE/M2.5/VIA]  (no BOM)
S2  M2.5  [HW/HOLE/M2.5/VIA]  (no BOM)
S3  M2.5  [HW/HOLE/M2.5/VIA]  (no BOM)
S4  M2.5  [HW/HOLE/M2.5/VIA]  (no BOM)

### Ports
GND

### Nets
GND: S1.1 S2.1 S3.1 S4.1 ; port GND

### Notes on the sheet
- Fiducials
- Board Fixation
- HES-SO / HEIG-VD / TIN / IAI
  Route de Cheseaux, 1
  CH-1401 Yverdon-les-Bains
  +41 24 557 73 77
  http://iai.heig-vd.ch
  iai@heig-vd.ch
- Title
- Format
- Date
- A4
- Project Name
- Author
- Project ID
- VCS
- Revision
- Page
- /
- File

### Library data of the parts
FID1-FID4 = FIDUCIAL
S1-S4 = HOLE/M2.5

## Nets that join several sheets
+1.2V: adc (R128.1), dsp-supply (C239.1 FB6#1.1), psu (6 pins)
+3.3V: main (9 pins), U_INVERTER-A (D14A.1 D14A.2 D14A.3), U_ENC-A (6 pins), can (C166.1 U35.3), U_INVERTER-B (D14B.1 D14B.2 D14B.3), dsp (J19.8 R8.1 R9.1), adc (C214#1.1 R129.1 U43.10), dsp-supply (11 pins), ethernet (19 pins), psu (16 pins), ext-memory (18 pins), usb (R50.2 R53.2), U_ENC-C (C106A.2 C107A.2 C149A.2 U30A.8), imu (C187.1 FB7#2.2 U42.7 U42.14), U_ENC-A (6 pins), sdcard (C188.1 J21.4 R127.1), U_ENC-D (C106B.2 C107B.2 C149B.2 U30B.8)
+3.3VA: U_INVERTER-A (12 pins), U_INVERTER-B (12 pins), adc (8 pins), dsp-supply (6 pins), psu (C15.1 C16.1 FB1.2 TP2.1)
+5V: main (19 pins), U_ENC-A (9 pins), dsp (C8.1 J19.13), adc (R130.1), psu (11 pins), usb (D7.1 U23.5), resolver-excitation (C164.1 FB6#2.1), U_ENC-C (7 pins), U_ENC-A (9 pins), U_ENC-D (7 pins)
GND: main (42 pins), U_INVERTER-A (76 pins), U_ENC-A (25 pins), can (6 pins), U_INVERTER-B (76 pins), dsp (5 pins), adc (31 pins), dsp-supply (133 pins), ethernet (18 pins), psu (63 pins), ext-memory (20 pins), usb (13 pins), resolver-excitation (15 pins), U_ENC-C (22 pins), imu (8 pins), U_ENC-A (25 pins), sdcard (7 pins), U_ENC-D (22 pins), mechanical (S1.1 S2.1 S3.1 S4.1)
VBUS: main (C1.1 C2.1 J1.1 R1.1), U_INVERTER-A (22 pins), U_INVERTER-B (22 pins), psu (13 pins)
+5VENCA: main (J4.1), U_ENC-A (U19A.5)
+5VENCB: main (J6.1), U_ENC-A (U19B.5)
+5VENCC: main (C5.1 J8.1), U_ENC-C (U27A.5)
+5VENCD: main (C6.1 J11.1), U_ENC-D (U27B.5)
+VLO: main (J2.1), psu (D6.2 Q4.1 R26.2)
A0: dsp (U8.T16), ext-memory (U24.H7 U25.A4)
A1: dsp (U8.W17), ext-memory (U24.H8 U25.A5)
A2: dsp (U8.V17), ext-memory (U24.J8 U25.B3)
A3: dsp (U8.U17), ext-memory (U24.J7 U25.B4)
A4: dsp (U8.K18), ext-memory (U24.J3 U25.C3)
A5: dsp (U8.K19), ext-memory (U24.J2 U25.C4)
A6: dsp (U8.E19), ext-memory (U24.H3 U25.D4)
A7: dsp (U8.E18), ext-memory (U24.H2 U25.H2)
A8: dsp (U8.R16), ext-memory (U24.H1 U25.H3)
A9: dsp (U8.R17), ext-memory (U24.G3 U25.H4)
A10: dsp (U8.R18), ext-memory (U24.H9 U25.H5)
A11: dsp (U8.R19), ext-memory (U24.G2 U25.G3)
A12: dsp (U8.P16), ext-memory (U24.G1 U25.G4)
A13: dsp (U8.C11), ext-memory (U25.F3)
A14: dsp (U8.D11), ext-memory (U25.F4)
A15: dsp (U8.C6), ext-memory (U24.E8 U25.E4)
A16: dsp (U8.D6), ext-memory (U24.F1 U25.D3)
ADC1: dsp (J19.6), adc (U15#1.T7)
BA0: dsp (U8.F2), ext-memory (U24.G7)
BA1: dsp (U8.F3), ext-memory (U24.G8 U25.A3)
~{CAS}: dsp (U8.K4), ext-memory (U24.F7)
~{CS0}: dsp (U8.U13), ext-memory (U24.G9)
~{CS2}: dsp (U8.V11), ext-memory (U25.B5)
CANH: main (J16.2 J18.35), can (C167.1 D11.2 L5.1)
CANL: main (J16.3 J18.36), can (C168.1 D11.1 L5.2)
CLK: dsp (U8.T11), ext-memory (U24.F2)
DAC0: dsp (J19.2), adc (U15#1.T1)
DAC1: dsp (J19.4), adc (U15#1.W2)
DATA READY: dsp (U8.C18), imu (U42.22)
DENCB.CLK: dsp (U8.G2), U_ENC-A (U20B.5)
DETECT: dsp (U8.L17), sdcard (J21.10)
DSP-~{XRST}: dsp-supply (U8.F19), psu (6 pins)
ENCA-A+: main (J4.3 J18.2), U_ENC-A (C65A.1 R47A.1 U20A.8)
ENCA-A-: main (J4.4 J18.3), U_ENC-A (C66A.1 R47A.2 U20A.9)
ENCA-B+: main (J4.5 J18.4), U_ENC-A (C69A.1 R48A.1 U21A.8)
ENCA-B-: main (J4.6 J18.5), U_ENC-A (C70A.1 R48A.2 U21A.9)
ENCA-C+: main (J4.7 J18.6), U_ENC-A (C73A.1 R49A.1 U22A.8)
ENCA-C-: main (J4.8 J18.7), U_ENC-A (C74A.1 R49A.2 U22A.9)
ENCB-A+: main (J6.3 J18.9), U_ENC-A (C65B.1 R47B.1 U20B.8)
ENCB-A-: main (J6.4 J18.10), U_ENC-A (C66B.1 R47B.2 U20B.9)
ENCB-B+: main (J6.5 J18.11), U_ENC-A (C69B.1 R48B.1 U21B.8)
ENCB-B-: main (J6.6 J18.12), U_ENC-A (C70B.1 R48B.2 U21B.9)
ENCB-C+: main (J6.7 J18.13), U_ENC-A (C73B.1 R49B.1 U22B.8)
ENCB-C-: main (J6.8 J18.14), U_ENC-A (C74B.1 R49B.2 U22B.9)
ENCC-A+: main (J8.3 J18.16), U_ENC-C (C112A.1 R70A.2 R71A.2)
ENCC-A-: main (J8.4 J18.17), U_ENC-C (C109A.1 R20A.2 R70A.1)
ENCC-B+: main (J8.5 J18.18), U_ENC-C (C101A.1 R67A.2 R77A.2)
ENCC-B-: main (J8.6 J18.19), U_ENC-C (C102A.1 R67A.1 R75A.2)
ENCC-C+: main (J8.7 J18.20), U_ENC-C (SW2A.5)
ENCC-C-: main (J8.8 J18.21), U_ENC-C (SW2A.2)
ENCD-A+: main (J11.3 J18.23), U_ENC-D (C112B.1 R70B.2 R71B.2)
ENCD-A-: main (J11.4 J18.24), U_ENC-D (C109B.1 R20B.2 R70B.1)
ENCD-B+: main (J11.5 J18.25), U_ENC-D (C101B.1 R67B.2 R77B.2)
ENCD-B-: main (J11.6 J18.26), U_ENC-D (C102B.1 R67B.1 R75B.2)
ENCD-C+: main (J11.7 J18.27), U_ENC-D (SW2B.5)
ENCD-C-: main (J11.8 J18.28), U_ENC-D (SW2B.2)
ExEn: dsp (U8.D9), resolver-excitation (R110.2 U34.4)
ExIn: dsp (U8.C9), resolver-excitation (R105.1 TP7#2.1)
ExOut: resolver-excitation (C156.2), U_ENC-C (SW2A.3), U_ENC-D (SW2B.3)
HALLA-OUT: main (U4.7), dsp (U8.K17)
HALLB-OUT: main (U5.7), dsp (U8.B19)
ID: dsp (U8.P17), usb (5 pins)
IMU-~{RST}: dsp (U8.T9), imu (U42.6)
LIMIT-SW0A: main (U1.10), dsp (U8.U10)
LIMIT-SW0B: main (U2.10), dsp (U8.C13)
LIMIT-SW1A: main (U1.9), dsp (U8.T19)
LIMIT-SW1B: main (U2.9), dsp (U8.D14)
LIMIT-SW2A: main (U1.8), dsp (U8.B10)
LIMIT-SW2B: main (U2.8), dsp (U8.V10)
MON-VBUS: main (R1.2 R2.1), adc (C213#1.1 U15#1.U4)
MON-VUSB: adc (U43.2), usb (R52.1 R54.2)
NetR44_2: dsp (U8.L2), ethernet (R44.2 U16.19)
NetU8_A2: U_ENC-A (U21A.2), dsp (U8.A2 U8.M17)
NetU8_A6: U_ENC-A (U20A.5), dsp (U8.A6)
NetU8_C3: U_ENC-A (U20A.2), dsp (U8.C3)
NetU8_C7: U_ENC-A (U21A.3), dsp (U8.C7)
NetU8_D2: dsp (U8.D2), imu (U42.24)
NetU8_D3: dsp (U8.D3), imu (U42.23)
NetU8_D7: U_ENC-A (U20A.3), dsp (U8.D7)
NetU8_F1: dsp (U8.F1), U_ENC-A (U21B.3)
NetU8_G1: U_ENC-A (U22A.2), dsp (U8.G1)
NetU8_H1: dsp (U8.H1 U8.K2), U_ENC-A (U21B.2)
NetU8_H2: dsp (U8.H2), U_ENC-A (U21B.5)
NetU8_J3: dsp (U8.J3), ethernet (U16.20)
NetU8_K1: dsp (U8.K1), U_ENC-A (U22B.2)
NetU8_K3: dsp (U8.K3), U_ENC-A (U20B.2)
NetU8_L3: dsp (U8.L3), U_ENC-A (U20B.3)
NetU8_L4: dsp (U8.L4), ethernet (U16.8)
NetU8_L16: U_ENC-A (U21A.5), dsp (U8.L16)
NetU8_M2: dsp (U8.M2), ethernet (U16.29)
NetU8_M3: dsp (U8.M3), ethernet (U16.26)
NetU8_M4: dsp (U8.M4), ethernet (U16.25)
NetU8_N2: dsp (U8.N2), ethernet (U16.27)
NetU8_N3: dsp (U8.N3), ethernet (U16.30)
NetU8_N4: dsp (U8.N4), ethernet (U16.28)
NetU8_T8: dsp (U8.T8), ethernet (U16.5)
NetU8_T12: dsp (U8.T12), ethernet (U16.3)
NetU8_T15: dsp (U8.T15), ethernet (U16.18)
NetU8_U8: dsp (U8.U8), ethernet (U16.6)
NetU8_U12: dsp (U8.U12), ethernet (U16.1)
NetU8_U15: dsp (U8.U15), ethernet (U16.2)
NetU8_V8: dsp (U8.V8), ethernet (U16.7)
NetU8_V12: dsp (U8.V12), ethernet (U16.31)
NetU8_W10: dsp (U8.W10), ethernet (U16.32)
NetU8_W16: dsp (U8.W16), ethernet (U16.4)
~{OE}: dsp (U8.U16), ext-memory (U25.A2)
PSU-OVER-VOLTAGE: dsp (U8.U9), psu (5 pins)
PWR-EN: dsp (U8.A13), usb (Q5.3 R51.2 U23.4)
PWR-FAULT: dsp (U8.B13), usb (R53.1 U23.3)
~{RAS}: dsp (U8.J4), ext-memory (U24.F8)
SDKE: dsp (U8.W11), ext-memory (U24.F3)
UA: main (J9.1), U_INVERTER-A (C175A.2 L6A.2)
UB: main (J14.2), U_INVERTER-B (C175B.2 L6B.2)
USB_N: dsp (U8.D19), usb (D8.6 J5#2.2)
USB_P: dsp (U8.C19), usb (D8.1 J5#2.3)
VA: main (J9.2), U_INVERTER-A (C176A.2 L7A.2)
VB: main (J14.4), U_INVERTER-B (C176B.2 L7B.2)
~{WE}: dsp (U8.U11), ext-memory (U24.F9 U25.G5)
WA: main (J9.3), U_INVERTER-A (C177A.2 L8A.2)
WB: main (J14.3), U_INVERTER-B (C177B.2 L8B.2)